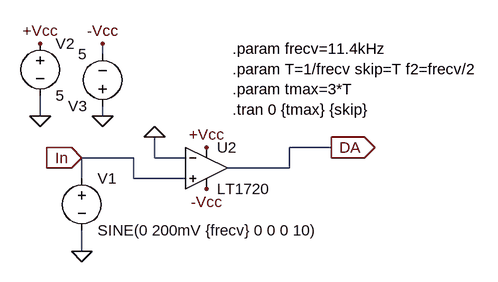
[diagram p0: schematic Draft1.asc]
Draft1.asc, the LTspice schematic file:
Version 4
SHEET 1 880 680
WIRE 64 48 64 32
WIRE -32 144 -32 112
WIRE 64 144 64 128
WIRE 416 192 352 192
WIRE 112 208 32 208
WIRE 144 208 144 176
WIRE 192 208 144 208
WIRE 352 224 352 192
WIRE 352 224 256 224
WIRE 32 240 32 208
WIRE 112 240 112 208
WIRE 192 240 112 240
WIRE 32 352 32 320
FLAG 224 192 +Vcc
FLAG 224 256 -Vcc
FLAG 32 352 0
FLAG -32 32 +Vcc
FLAG 64 32 -Vcc
FLAG -32 144 0
FLAG 64 144 0
FLAG 32 208 In
IOPIN 32 208 In
FLAG 416 192 DA
IOPIN 416 192 Out
FLAG 144 176 0
SYMBOL voltage 32 224 R0
WINDOW 123 0 0 Left 0
WINDOW 39 0 0 Left 0
SYMATTR InstName V1
SYMATTR Value SINE(0 200mV {frecv} 0 0 0 10)
SYMBOL voltage -32 16 R0
SYMATTR InstName V2
SYMATTR Value 5
SYMBOL voltage 64 144 R180
WINDOW 123 0 0 Left 0
WINDOW 39 0 0 Left 0
SYMATTR InstName V3
SYMATTR Value 5
SYMBOL Comparators\\LT1720 224 160 R0
SYMATTR InstName U2
TEXT 264 40 Left 2 !.param frecv=11.4kHz\n.param T=1/frecv skip=T f2=frecv/2\n.param tmax=3*T\n.tran 0 {tmax} {skip}

The netlist it stands for:
* Draft1.asc
V1 In 0 SINE(0 200mV {frecv} 0 0 0 10)
V2 +Vcc 0 5
V3 0 -Vcc 5
XU2 In 0 +Vcc -Vcc DA LT1720  ; pins In+ In- V+ V- OUT
.param frecv=11.4kHz
.param T=1/frecv skip=T f2=frecv/2
.param tmax=3*T
.tran 0 {tmax} {skip}
.lib LT1720.sub
.backanno
.end